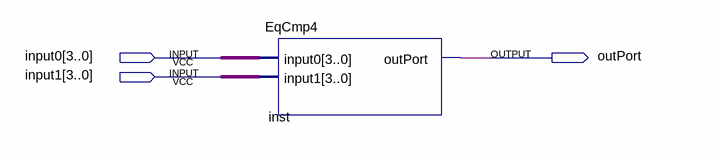
[diagram p0: schematic sheet]
// Quartus schematic EqCmpDemo.bdf as structural Verilog: 1 symbols, 3 pins
module EqCmpDemo (
  input  [3:0] input0,
  input  [3:0] input1,
  output outPort
);

  EqCmp4 inst (.input0(input0), .input1(input1), .outPort(outPort));
endmodule
